# Altium schematic sheet RPi&MCU.SchDoc: RPi
size A4; Date: 08.04.2017; Author: Jan Petrik; CompanyName: FreeDSP; DrawnBy: Jan Petrik; Organization: FreeDSP; DocumentNumber: 9; Revision: B2; SheetNumber: 9; SheetTotal: 16; email: jan_petrik@centrum.cz; license: CC BY-NC 4.0
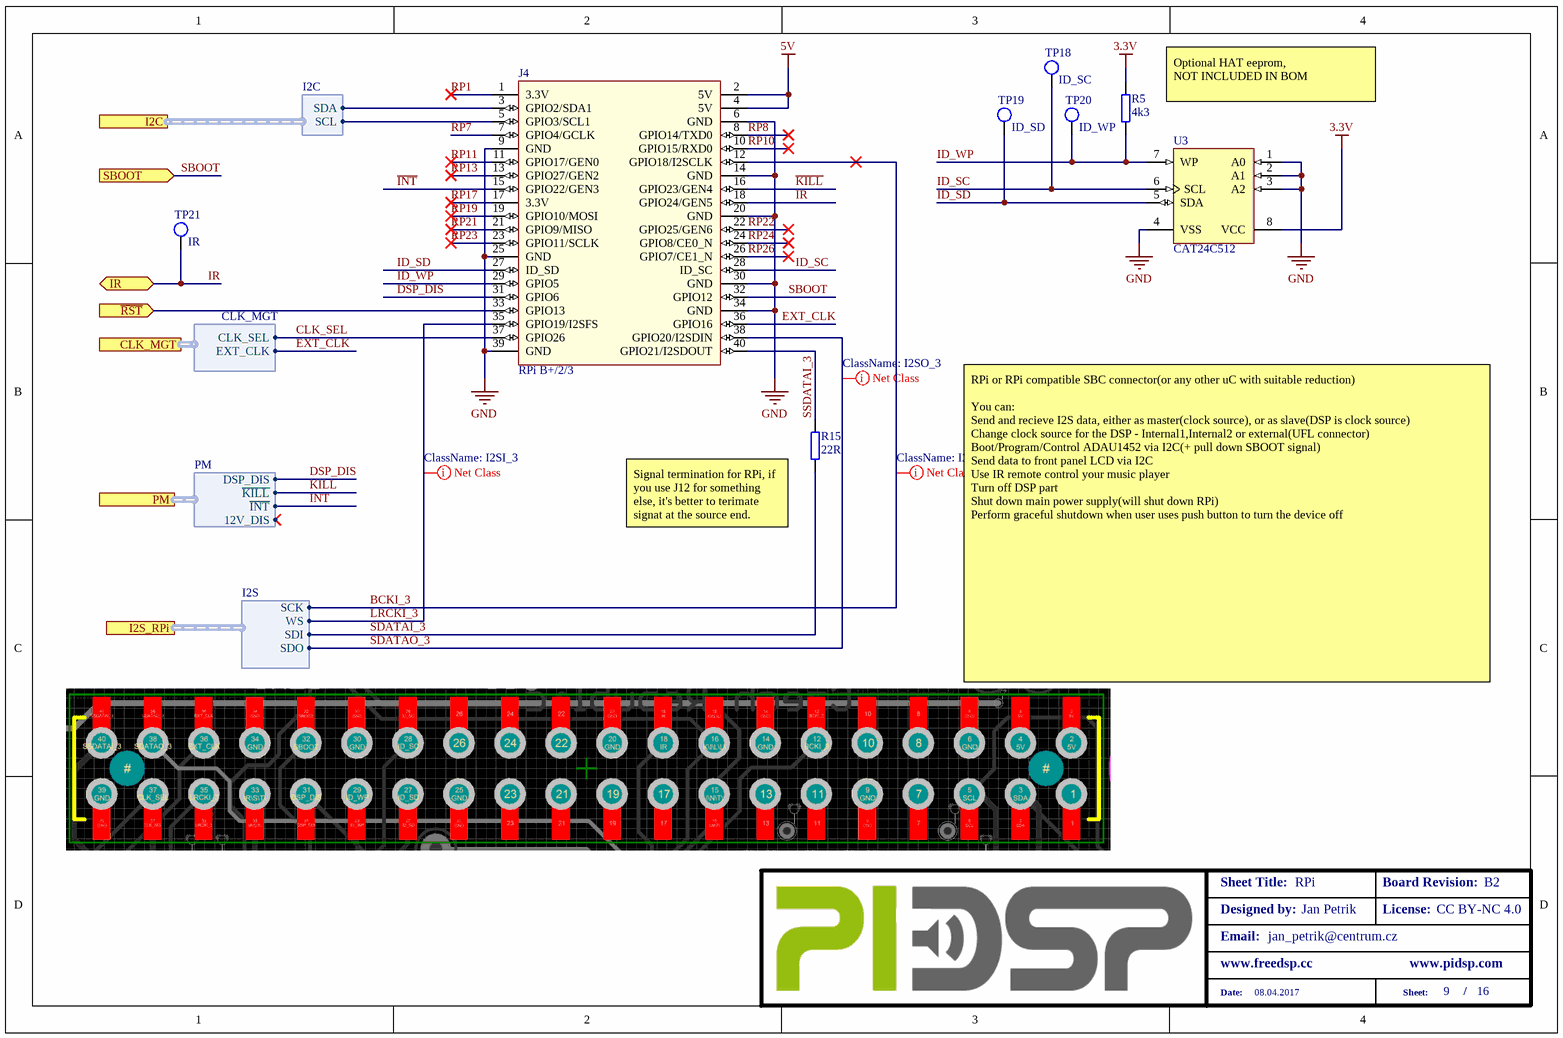
[diagram p0: RPi&MCU.SchDoc]

## Parts
J4  RPi B+/2/3  [RPi 2]
R5  4k3  [RESC1608X06N(SMR0603)]
R15  22R  [RESC1608X06N(SMR0603)]
TP18  ID_SC  [TP_0.8/0.4_ROUND]  (no BOM)
TP19  ID_SD  [TP_0.8/0.4_ROUND]  (no BOM)
TP20  ID_WP  [TP_0.8/0.4_ROUND]  (no BOM)
TP21  IR  [TP_0.8/0.4_ROUND]  (no BOM)
U3  CAT24C512  [SOIC127P600X175-8N(SOIC_8)]

## Ports
CLK_MGT (harness CLK_MGT), I2C (harness I2C), I2S_RPi (harness I2S), IR (bidir), PM (harness PM), SBOOT (in), ~{RST} (in)

## Harnesses
I2C: SDA, SCL
I2S: SDI, WS, SCK, SDO
PM: ~{INT}, ~{KILL}, DSP_DIS, 12V_DIS
CLK_MGT: EXT_CLK, CLK_SEL

## Nets
3.3V: R5.2 U3.8(VCC)
5V: J4.2(5V) J4.4(5V)
GND: J4.6(GND) J4.9(GND) J4.14(GND) J4.20(GND) J4.25(GND) J4.30(GND) J4.34(GND) J4.39(GND) U3.1(A0) U3.2(A1) U3.3(A2) U3.4(VSS)
~{RST}: J4.33(GPIO13) ; port ~{RST}
BCKI_3: J4.12(GPIO18/I2SCLK) ; port I2S_RPi.SCK
CLK_SEL: J4.37(GPIO26) ; port CLK_MGT.CLK_SEL
DSP_DIS: J4.31(GPIO6) ; port PM.DSP_DIS
EXT_CLK: J4.36(GPIO16) ; port CLK_MGT.EXT_CLK
~{INT}: J4.15(GPIO22/GEN3) ; port PM.~{INT}
ID_SC: J4.28(ID_SC) TP18.1 U3.6(SCL)
ID_SD: J4.27(ID_SD) TP19.1 U3.5(SDA)
ID_WP: J4.29(GPIO5) R5.1 TP20.1 U3.7(WP)
IR: J4.18(GPIO24/GEN5) TP21.1 ; port IR
~{KILL}: J4.16(GPIO23/GEN4) ; port PM.~{KILL}
LRCKI_3: J4.35(GPIO19/I2SFS) ; port I2S_RPi.WS
RP1: J4.1(3.3V)
RP7: J4.7(GPIO4/GCLK)
RP8: J4.8(GPIO14/TXD0)
RP10: J4.10(GPIO15/RXD0)
RP11: J4.11(GPIO17/GEN0)
RP13: J4.13(GPIO27/GEN2)
RP17: J4.17(3.3V)
RP19: J4.19(GPIO10/MOSI)
RP21: J4.21(GPIO9/MISO)
RP22: J4.22(GPIO25/GEN6)
RP23: J4.23(GPIO11/SCLK)
RP24: J4.24(GPIO8/CE0_N)
RP26: J4.26(GPIO7/CE1_N)
SBOOT: J4.32(GPIO12) ; port SBOOT
SDATAI_3: R15.1 ; port I2S_RPi.SDI
SDATAO_3: J4.38(GPIO20/I2SDIN) ; port I2S_RPi.SDO
SSDATAI_3: J4.40(GPIO21/I2SDOUT) R15.2
NetJ4_3: J4.3(GPIO2/SDA1) ; port I2C.SDA
NetJ4_5: J4.5(GPIO3/SCL1) ; port I2C.SCL

## Layout directives
net class I2SO_3: SDATAO_3
net class I2SI_3: BCKI_3, LRCKI_3

## Notes on the sheet
- Optional HAT eeprom,
  NOT INCLUDED IN BOM
- (near R15) Signal termination for RPi, if you use J12 for something else, it's better to terimate signat at the source end.
- RPi or RPi compatible SBC connector(or any other uC with suitable reduction)
  You can:
  Send and recieve I2S data, either as master(clock source), or as slave(DSP is clock source)
  Change clock source for the DSP - Internal1,Internal2 or external(UFL connector)
  Boot/Program/Control ADAU1452 via I2C(+ pull down SBOOT signal)
  Send data to front panel LCD via I2C
  Use IR remote control your music player
  Turn off DSP part
  Shut down main power supply(will shut down RPi)
  Perform graceful shutdown when user uses push button to turn the device off
- Designed by:
- Sheet Title:
- Board Revision:
- License:
- Email:
- www.freedsp.cc
- www.pidsp.com
- Date:
- Sheet:
- /

## Library data of the parts
J4 = Rapsberry Pi 2 B: Rapsberry Pi Header; SMD: 0; Supplier 1: Mouser; Supplier Part Number 1: 517-929975-01-20
R5 = 4K3-100mW-0603-ThickFilm: Chip Resistor; Tolerance & Rating: 1%/0.1W; Signal Integrity: Res; Packare: SMR0603; Value: 4k3; Simulation: Res; Author: JP/10.06.2014; SMD: 1; Supplier 1: Mouser; Supplier Part Number 1: 603-RC0603FR-074K3L; Type: Resistor
R15 = 22R-100mW-0603-ThickFilm: Chip Resistor; Tolerance & Rating: 1%/0.1W; Signal Integrity: Res; Packare: SMR0603; Value: 22R; Simulation: Res; Author: JP/10.06.2014; SMD: 1; Supplier 1: Mouser; Supplier Part Number 1: 603-RC0603FR-0722RL; Type: Resistor
TP18-TP21 = TEST_POINT_VIA: Testpoint - VIA; Value: 0.65/1.55; SMD: -; ClassName: TP
U3 = CAT24C512: 512 Kb I2C CMOS Serial  EEPROM; Supplier 1: Mouser; Supplier Part Number 1: 863-CAT24C512WI-GT3